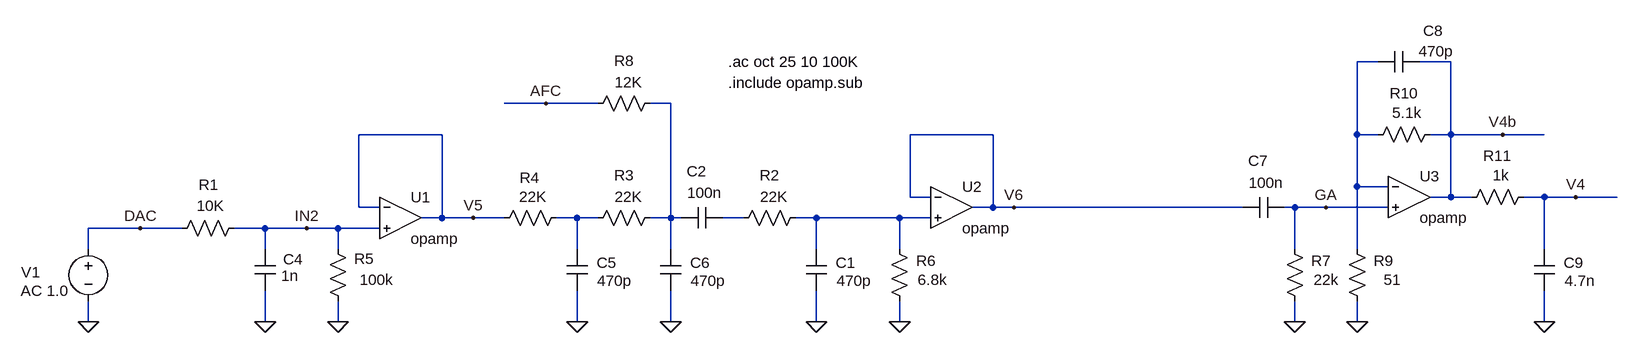
[diagram p0: schematic opamp_10k.asc]
opamp_10k.asc, the LTspice schematic file:
Version 4.1
SHEET 1 5945676 13421556
WIRE 2992 -160 2960 -160
WIRE 3104 -160 3056 -160
WIRE 1712 -96 1648 -96
WIRE 1792 -96 1712 -96
WIRE 1904 -96 1872 -96
WIRE 1552 -48 1424 -48
WIRE 2400 -48 2272 -48
WIRE 2960 -48 2960 -160
WIRE 2992 -48 2960 -48
WIRE 3104 -48 3104 -160
WIRE 3104 -48 3072 -48
WIRE 3184 -48 3104 -48
WIRE 3248 -48 3184 -48
WIRE 2960 32 2960 -48
WIRE 3008 32 2960 32
WIRE 2272 48 2272 -48
WIRE 2304 48 2272 48
WIRE 3104 48 3104 -48
WIRE 3104 48 3072 48
WIRE 3136 48 3104 48
WIRE 3248 48 3216 48
WIRE 3296 48 3248 48
WIRE 3360 48 3296 48
WIRE 1424 64 1424 -48
WIRE 1456 64 1424 64
WIRE 2400 64 2400 -48
WIRE 2400 64 2368 64
WIRE 2432 64 2400 64
WIRE 2784 64 2432 64
WIRE 2864 64 2848 64
WIRE 2912 64 2864 64
WIRE 3008 64 2912 64
WIRE 1552 80 1552 -48
WIRE 1552 80 1520 80
WIRE 1600 80 1552 80
WIRE 1648 80 1600 80
WIRE 1760 80 1728 80
WIRE 1792 80 1760 80
WIRE 1904 80 1904 -96
WIRE 1904 80 1872 80
WIRE 1920 80 1904 80
WIRE 2016 80 1984 80
WIRE 2128 80 2096 80
WIRE 2256 80 2128 80
WIRE 2304 80 2256 80
WIRE 1088 96 1008 96
WIRE 1152 96 1088 96
WIRE 1280 96 1232 96
WIRE 1344 96 1280 96
WIRE 1392 96 1344 96
WIRE 1456 96 1392 96
WIRE 1008 128 1008 96
WIRE 1280 128 1280 96
WIRE 1392 128 1392 96
WIRE 1760 128 1760 80
WIRE 1904 128 1904 80
WIRE 2128 128 2128 80
WIRE 2256 128 2256 80
WIRE 2864 128 2864 64
WIRE 2960 128 2960 32
WIRE 3248 128 3248 48
WIRE 1008 240 1008 208
WIRE 1280 240 1280 192
WIRE 1392 240 1392 208
WIRE 1760 240 1760 192
WIRE 1904 240 1904 192
WIRE 2128 240 2128 192
WIRE 2256 240 2256 208
WIRE 2864 240 2864 208
WIRE 2960 240 2960 208
WIRE 3248 240 3248 192
FLAG 1008 240 0
FLAG 2432 64 V6
FLAG 1600 80 V5
FLAG 1280 240 0
FLAG 1760 240 0
FLAG 1904 240 0
FLAG 2256 240 0
FLAG 1392 240 0
FLAG 1712 -96 AFC
FLAG 1088 96 DAC
FLAG 1344 96 IN2
FLAG 2864 240 0
FLAG 2912 64 GA
FLAG 2960 240 0
FLAG 3296 48 V4
FLAG 3248 240 0
FLAG 3184 -48 V4b
FLAG 2128 240 0
SYMBOL voltage 1008 112 R0
WINDOW 0 -103 52 Left 2
WINDOW 3 -104 52 Left 2
WINDOW 123 -104 80 Left 2
WINDOW 39 0 0 Left 0
SYMATTR InstName V1
SYMATTR Value ""
SYMATTR Value2 AC 1.0
SYMBOL res 1248 80 R90
WINDOW 0 -35 55 VBottom 2
WINDOW 3 -34 52 VTop 2
SYMATTR InstName R1
SYMATTR Value 10K
SYMBOL res 1744 64 R90
WINDOW 0 -30 57 VBottom 2
WINDOW 3 -32 52 VTop 2
SYMATTR InstName R4
SYMATTR Value 22K
SYMBOL res 2272 224 R180
WINDOW 0 -40 78 Left 2
WINDOW 3 -58 49 Left 2
SYMATTR InstName R6
SYMATTR Value 6.8k
SYMBOL OPAMPS\\OPAMP 1488 16 R0
SYMATTR InstName U1
SYMATTR SpiceLine2 GBW=3Meg
SYMBOL OPAMPS\\OPAMP 2336 0 R0
SYMATTR InstName U2
SYMATTR SpiceLine2 GBW=3Meg
SYMBOL res 1888 64 R90
WINDOW 0 -34 56 VBottom 2
WINDOW 3 -32 49 VTop 2
SYMATTR InstName R3
SYMATTR Value 22K
SYMBOL cap 1984 64 R90
WINDOW 0 -40 40 VBottom 2
WINDOW 3 -38 28 VTop 2
SYMATTR InstName C2
SYMATTR Value 100n
SYMBOL cap 1264 192 M180
WINDOW 0 44 48 Left 2
WINDOW 3 41 23 Left 2
SYMATTR InstName C4
SYMATTR Value 1n
SYMBOL cap 1744 192 M180
WINDOW 0 46 43 Left 2
WINDOW 3 47 15 Left 2
SYMATTR InstName C5
SYMATTR Value 470p
SYMBOL cap 1888 192 M180
WINDOW 0 46 43 Left 2
WINDOW 3 47 15 Left 2
SYMATTR InstName C6
SYMATTR Value 470p
SYMBOL res 1408 224 R180
WINDOW 0 -40 81 Left 2
WINDOW 3 -70 49 Left 2
SYMATTR InstName R5
SYMATTR Value 100k
SYMBOL cap 2848 48 R90
WINDOW 0 -40 40 VBottom 2
WINDOW 3 -38 28 VTop 2
SYMATTR InstName C7
SYMATTR Value 100n
SYMBOL res 2880 224 R180
WINDOW 0 -40 78 Left 2
WINDOW 3 -52 49 Left 2
SYMATTR InstName R7
SYMATTR Value 22k
SYMBOL OPAMPS\\OPAMP 3040 -16 R0
SYMATTR InstName U3
SYMATTR SpiceLine2 GBW=3Meg
SYMBOL res 2976 224 R180
WINDOW 0 -40 78 Left 2
WINDOW 3 -52 49 Left 2
SYMATTR InstName R9
SYMATTR Value 51
SYMBOL res 3088 -64 R90
WINDOW 0 -32 56 VBottom 2
WINDOW 3 -33 51 VTop 2
SYMATTR InstName R10
SYMATTR Value 5.1k
SYMBOL cap 3056 -176 R90
WINDOW 0 -16 -21 VBottom 2
WINDOW 3 -16 -26 VTop 2
SYMATTR InstName C8
SYMATTR Value 470p
SYMBOL res 3232 32 R90
WINDOW 0 -32 56 VBottom 2
WINDOW 3 -33 51 VTop 2
SYMATTR InstName R11
SYMATTR Value 1k
SYMBOL cap 3232 192 M180
WINDOW 0 46 43 Left 2
WINDOW 3 47 15 Left 2
SYMATTR InstName C9
SYMATTR Value 4.7n
SYMBOL res 2112 64 R90
WINDOW 0 -34 56 VBottom 2
WINDOW 3 -32 49 VTop 2
SYMATTR InstName R2
SYMATTR Value 22K
SYMBOL cap 2112 192 M180
WINDOW 0 46 43 Left 2
WINDOW 3 47 15 Left 2
SYMATTR InstName C1
SYMATTR Value 470p
SYMBOL res 1888 -112 R90
WINDOW 0 -34 56 VBottom 2
WINDOW 3 -32 49 VTop 2
SYMATTR InstName R8
SYMATTR Value 12K
TEXT 1992 -160 Left 2 !.ac oct 25 10 100K
TEXT 1992 -128 Left 2 !.include opamp.sub

The netlist it stands for:
* opamp_10k.asc
V1 DAC 0 AC 1.0
R1 IN2 DAC 10K
R4 N003 V5 22K
R6 0 N005 6.8k
X§U1 V5 IN2 V5 opamp Aol=100K GBW=3Meg  ; pins invin noninvin out
X§U2 V6 N005 V6 opamp Aol=100K GBW=3Meg  ; pins invin noninvin out
R3 N002 N003 22K
C2 N004 N002 100n
C4 0 IN2 1n
C5 0 N003 470p
C6 0 N002 470p
R5 0 IN2 100k
C7 GA V6 100n
R7 0 GA 22k
X§U3 N001 GA V4b opamp Aol=100K GBW=3Meg  ; pins invin noninvin out
R9 0 N001 51
R10 V4b N001 5.1k
C8 V4b N001 470p
R11 V4 V4b 1k
C9 0 V4 4.7n
R2 N005 N004 22K
C1 0 N005 470p
R8 N002 AFC 12K
.ac oct 25 10 100K
.include opamp.sub
.backanno
.end